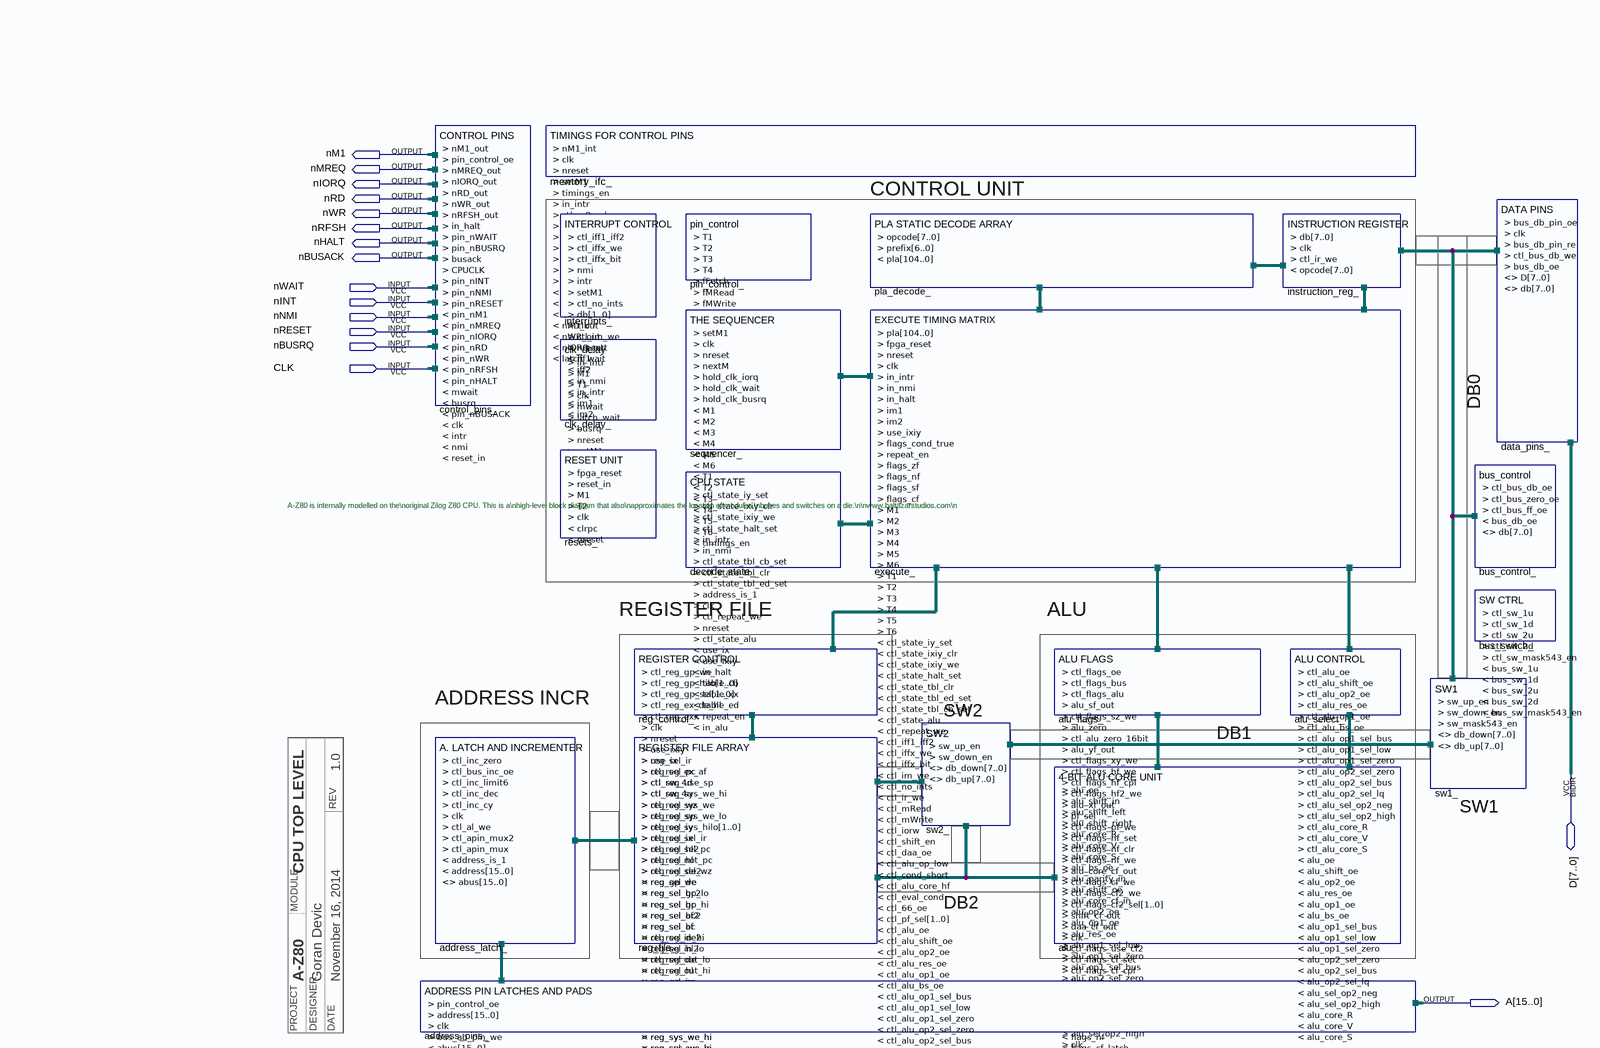
[diagram p0: schematic sheet]
// Quartus schematic toplevel.bdf as structural Verilog: 23 symbols, 16 pins
// Title block: DATE: November 16, 2014; DESIGNER: Goran Devic; MODULE: CPU TOP LEVEL; PROJECT: A-Z80; REV: 1.0
module toplevel (
  input  nWAIT,
  input  nINT,
  input  nNMI,
  input  nRESET,
  input  nBUSRQ,
  input  CLK,
  inout  [7:0] D,
  output nM1,
  output nMREQ,
  output nIORQ,
  output nRD,
  output nWR,
  output nRFSH,
  output nHALT,
  output nBUSACK,
  output [15:0] A
);

  wire alu_bs_oe, alu_core_cf_out, alu_core_R, alu_core_S, alu_core_V, alu_oe, alu_op1_oe, alu_op1_sel_bus,
       alu_op1_sel_low, alu_op1_sel_zero, alu_op2_oe, alu_op2_sel_bus, alu_op2_sel_lq, alu_op2_sel_zero,
       alu_res_oe, alu_sel_op2_high, alu_sel_op2_neg, alu_sf_out, alu_shift_oe, alu_xf_out, alu_yf_out,
       alu_zero, bus_db_oe, ctl_alu_bs_oe, ctl_alu_core_R, ctl_alu_core_S, ctl_alu_core_V, ctl_alu_oe,
       ctl_alu_op1_oe, ctl_alu_op1_sel_bus, ctl_alu_op1_sel_low, ctl_alu_op1_sel_zero, ctl_alu_op2_oe,
       ctl_alu_op2_sel_bus, ctl_alu_op2_sel_lq, ctl_alu_op2_sel_zero, ctl_alu_res_oe, ctl_alu_sel_op2_high,
       ctl_alu_sel_op2_neg, ctl_alu_shift_oe, ctl_alu_zero_16bit, ctl_flags_alu, ctl_flags_bus,
       ctl_flags_cf2_we, ctl_flags_cf_cpl, ctl_flags_cf_set, ctl_flags_cf_we, ctl_flags_hf2_we,
       ctl_flags_hf_cpl, ctl_flags_hf_we, ctl_flags_nf_clr, ctl_flags_nf_set, ctl_flags_nf_we, ctl_flags_oe,
       ctl_flags_pf_we, ctl_flags_sz_we, ctl_flags_use_cf2, ctl_flags_xy_we, ctl_ir_we, ctl_reg_ex_af,
       ctl_reg_ex_de_hl, ctl_reg_exx, ctl_reg_gp_we, ctl_reg_not_pc, ctl_reg_sel_ir, ctl_reg_sel_pc,
       ctl_reg_sel_wz, ctl_reg_sys_we, ctl_reg_sys_we_hi, ctl_reg_sys_we_lo, ctl_reg_use_sp, ctl_repeat_we,
       ctl_state_alu, ctl_state_halt_set, ctl_state_ixiy_clr, ctl_state_ixiy_we, ctl_state_iy_set,
       ctl_state_tbl_cb_set, ctl_state_tbl_clr, ctl_state_tbl_ed_set, flags_cf, flags_nf, flags_sf, flags_zf,
       in_halt, in_intr, in_nmi, M1, M2, M3, M4, M5, M6, nextM, reg_gp_we, reg_sel_af, reg_sel_af2,
       reg_sel_bc, reg_sel_bc2, reg_sel_de, reg_sel_de2, reg_sel_gp_hi, reg_sel_gp_lo, reg_sel_hl,
       reg_sel_hl2, reg_sel_ir, reg_sel_ix, reg_sel_iy, reg_sel_pc, reg_sel_sp, reg_sel_sys_hi,
       reg_sel_sys_lo, reg_sel_wz, reg_sys_we_hi, reg_sys_we_lo, repeat_en, setM1, sw_down_en, sw_up_en, T1,
       T2, T3, T4, T5, T6, use_ixiy;
  wire [1:0] ctl_flags_cf2_sel, ctl_reg_gp_hilo, ctl_reg_gp_sel, ctl_reg_sys_hilo;
  wire [7:0] db, db0, db_down, db_up, opcode;
  wire [15:0] abus, address;
  wire [104:0] pla;

  \CONTROL_PINS  control_pins_ (
    .pin_nWAIT(nWAIT), .pin_nBUSRQ(nBUSRQ), .CPUCLK(CLK), .pin_nINT(nINT), .pin_nNMI(nNMI),
    .pin_nRESET(nRESET), .pin_nM1(nM1), .pin_nMREQ(nMREQ), .pin_nIORQ(nIORQ), .pin_nRD(nRD), .pin_nWR(nWR),
    .pin_nRFSH(nRFSH), .pin_nHALT(nHALT), .pin_nBUSACK(nBUSACK));  // open: nM1_out, pin_control_oe, nMREQ_out, nIORQ_out, nRD_out, nWR_out, nRFSH_out, in_halt, busack, mwait, busrq, clk, intr, nmi, reset_in
  \A._LATCH_AND_INCREMENTER  address_latch_ (
    .clk(CLK), .address(address), .abus(abus));  // open: ctl_inc_zero, ctl_bus_inc_oe, ctl_inc_limit6, ctl_inc_dec, ctl_inc_cy, ctl_al_we, ctl_apin_mux2, ctl_apin_mux, address_is_1
  \ADDRESS_PIN_LATCHES_AND_PADS  address_pins_ (
    .address(address), .clk(CLK), .abus(abus));  // open: pin_control_oe, bus_ab_pin_we
  \TIMINGS_FOR_CONTROL_PINS  memory_ifc_ ();  // open: nM1_int, clk, nreset, setM1, timings_en, in_intr, ctl_mRead, ctl_mWrite, ctl_iorw, fIORead, fIOWrite, iorq_Tw, hold_clk_wait, nM1_out, nRFSH_out, nMREQ_out, nRD_out, nWR_out, nIORQ_out, latch_wait
  \INTERRUPT_CONTROL  interrupts_ ();  // open: ctl_iff1_iff2, ctl_iffx_we, ctl_iffx_bit, nmi, intr, setM1, ctl_no_ints, db, clk, ctl_im_we, nreset, iff1, iff2, in_nmi, in_intr, im1, im2
  clk_delay clk_delay_ ();  // open: in_intr, M1, T1, clk, mwait, latch_wait, busrq, nreset, setM1, hold_clk_iorq, iorq_Tw, hold_clk_wait, busack, hold_clk_busrq, pin_control_oe
  \RESET_UNIT  resets_ ();  // open: fpga_reset, reset_in, M1, T2, clk, clrpc, nreset
  \REGISTER_CONTROL  reg_control_ (
    .ctl_reg_gp_we(ctl_reg_gp_we), .ctl_reg_gp_hilo(ctl_reg_gp_hilo), .ctl_reg_gp_sel(ctl_reg_gp_sel),
    .ctl_reg_ex_de_hl(ctl_reg_ex_de_hl), .ctl_reg_exx(ctl_reg_exx), .clk(CLK), .nreset(nRESET),
    .use_ixiy(use_ixiy), .ctl_reg_ex_af(ctl_reg_ex_af), .ctl_reg_use_sp(ctl_reg_use_sp),
    .ctl_reg_sys_we_hi(ctl_reg_sys_we_hi), .ctl_reg_sys_we(ctl_reg_sys_we),
    .ctl_reg_sys_we_lo(ctl_reg_sys_we_lo), .ctl_reg_sys_hilo(ctl_reg_sys_hilo),
    .ctl_reg_sel_ir(ctl_reg_sel_ir), .ctl_reg_sel_pc(ctl_reg_sel_pc), .ctl_reg_not_pc(ctl_reg_not_pc),
    .ctl_reg_sel_wz(ctl_reg_sel_wz), .reg_gp_we(reg_gp_we), .reg_sel_gp_lo(reg_sel_gp_lo),
    .reg_sel_gp_hi(reg_sel_gp_hi), .reg_sel_bc2(reg_sel_bc2), .reg_sel_bc(reg_sel_bc),
    .reg_sel_de2(reg_sel_de2), .reg_sel_hl2(reg_sel_hl2), .reg_sel_de(reg_sel_de), .reg_sel_hl(reg_sel_hl),
    .reg_sel_ix(reg_sel_ix), .reg_sel_iy(reg_sel_iy), .reg_sel_af2(reg_sel_af2), .reg_sel_af(reg_sel_af),
    .reg_sel_sp(reg_sel_sp), .reg_sys_we_hi(reg_sys_we_hi), .reg_sys_we_lo(reg_sys_we_lo),
    .reg_sel_sys_lo(reg_sel_sys_lo), .reg_sel_sys_hi(reg_sel_sys_hi), .reg_sel_ir(reg_sel_ir),
    .reg_sel_pc(reg_sel_pc), .reg_sel_wz(reg_sel_wz));  // open: use_ix
  \REGISTER_FILE_ARRAY  reg_file_ (
    .reg_sel_ir(reg_sel_ir), .reg_sel_pc(reg_sel_pc), .reg_sel_wz(reg_sel_wz), .reg_sel_sp(reg_sel_sp),
    .reg_sel_iy(reg_sel_iy), .reg_sel_ix(reg_sel_ix), .reg_sel_hl2(reg_sel_hl2), .reg_sel_hl(reg_sel_hl),
    .reg_sel_de2(reg_sel_de2), .reg_sel_de(reg_sel_de), .reg_sel_bc2(reg_sel_bc2), .reg_sel_bc(reg_sel_bc),
    .reg_sel_af2(reg_sel_af2), .reg_sel_af(reg_sel_af), .reg_gp_we(reg_gp_we), .reg_sys_we_lo(reg_sys_we_lo),
    .reg_sel_sys_lo(reg_sel_sys_lo), .reg_sel_gp_lo(reg_sel_gp_lo), .clk(CLK), .reg_sys_we_hi(reg_sys_we_hi),
    .reg_sel_sys_hi(reg_sel_sys_hi), .reg_sel_gp_hi(reg_sel_gp_hi));  // open: ctl_sw_4d, ctl_sw_4u, ctl_reg_in_hi, ctl_reg_in_lo, ctl_reg_out_lo, ctl_reg_out_hi, db_lo_ds, db_lo_as, db_hi_ds, db_hi_as
  pin_control pin_control_ ();  // open: T1, T2, T3, T4, fFetch, fMRead, fMWrite, fIORead, fIOWrite, bus_ab_pin_we, bus_db_pin_oe, bus_db_pin_re
  \THE_SEQUENCER  sequencer_ (
    .setM1(setM1), .clk(CLK), .nreset(nRESET), .nextM(nextM), .M1(M1), .M2(M2), .M3(M3), .M4(M4), .M5(M5),
    .M6(M6), .T1(T1), .T2(T2), .T3(T3), .T4(T4), .T5(T5), .T6(T6));  // open: hold_clk_iorq, hold_clk_wait, hold_clk_busrq, timings_en
  \CPU_STATE  decode_state_ (
    .ctl_state_iy_set(ctl_state_iy_set), .ctl_state_ixiy_clr(ctl_state_ixiy_clr),
    .ctl_state_ixiy_we(ctl_state_ixiy_we), .ctl_state_halt_set(ctl_state_halt_set), .in_intr(in_intr),
    .in_nmi(in_nmi), .ctl_state_tbl_cb_set(ctl_state_tbl_cb_set), .ctl_state_tbl_clr(ctl_state_tbl_clr),
    .ctl_state_tbl_ed_set(ctl_state_tbl_ed_set), .clk(CLK), .ctl_repeat_we(ctl_repeat_we), .nreset(nRESET),
    .ctl_state_alu(ctl_state_alu), .use_ixiy(use_ixiy), .in_halt(in_halt), .repeat_en(repeat_en));  // open: address_is_1, use_ix, table_cb, table_xx, table_ed, in_alu
  \PLA_STATIC_DECODE_ARRAY  pla_decode_ (.opcode(opcode), .pla(pla));  // open: prefix
  \EXECUTE_TIMING_MATRIX  execute_ (
    .pla(pla), .nreset(nRESET), .clk(CLK), .in_intr(in_intr), .in_nmi(in_nmi), .in_halt(in_halt),
    .use_ixiy(use_ixiy), .repeat_en(repeat_en), .flags_zf(flags_zf), .flags_nf(flags_nf),
    .flags_sf(flags_sf), .flags_cf(flags_cf), .M1(M1), .M2(M2), .M3(M3), .M4(M4), .M5(M5), .M6(M6), .T1(T1),
    .T2(T2), .T3(T3), .T4(T4), .T5(T5), .T6(T6), .ctl_state_iy_set(ctl_state_iy_set),
    .ctl_state_ixiy_clr(ctl_state_ixiy_clr), .ctl_state_ixiy_we(ctl_state_ixiy_we),
    .ctl_state_halt_set(ctl_state_halt_set), .ctl_state_tbl_clr(ctl_state_tbl_clr),
    .ctl_state_tbl_ed_set(ctl_state_tbl_ed_set), .ctl_state_tbl_cb_set(ctl_state_tbl_cb_set),
    .ctl_state_alu(ctl_state_alu), .ctl_repeat_we(ctl_repeat_we), .ctl_ir_we(ctl_ir_we),
    .ctl_alu_oe(ctl_alu_oe), .ctl_alu_shift_oe(ctl_alu_shift_oe), .ctl_alu_op2_oe(ctl_alu_op2_oe),
    .ctl_alu_res_oe(ctl_alu_res_oe), .ctl_alu_op1_oe(ctl_alu_op1_oe), .ctl_alu_bs_oe(ctl_alu_bs_oe),
    .ctl_alu_op1_sel_bus(ctl_alu_op1_sel_bus), .ctl_alu_op1_sel_low(ctl_alu_op1_sel_low),
    .ctl_alu_op1_sel_zero(ctl_alu_op1_sel_zero), .ctl_alu_op2_sel_zero(ctl_alu_op2_sel_zero),
    .ctl_alu_op2_sel_bus(ctl_alu_op2_sel_bus), .ctl_alu_op2_sel_lq(ctl_alu_op2_sel_lq),
    .ctl_alu_sel_op2_neg(ctl_alu_sel_op2_neg), .ctl_alu_sel_op2_high(ctl_alu_sel_op2_high),
    .ctl_alu_core_R(ctl_alu_core_R), .ctl_alu_core_V(ctl_alu_core_V), .ctl_alu_core_S(ctl_alu_core_S),
    .ctl_flags_oe(ctl_flags_oe), .ctl_flags_bus(ctl_flags_bus), .ctl_flags_alu(ctl_flags_alu),
    .ctl_flags_nf_set(ctl_flags_nf_set), .ctl_flags_cf_set(ctl_flags_cf_set),
    .ctl_flags_cf_cpl(ctl_flags_cf_cpl), .ctl_flags_cf_we(ctl_flags_cf_we),
    .ctl_flags_sz_we(ctl_flags_sz_we), .ctl_flags_xy_we(ctl_flags_xy_we), .ctl_flags_hf_we(ctl_flags_hf_we),
    .ctl_flags_pf_we(ctl_flags_pf_we), .ctl_flags_nf_we(ctl_flags_nf_we),
    .ctl_flags_cf2_we(ctl_flags_cf2_we), .ctl_flags_hf_cpl(ctl_flags_hf_cpl),
    .ctl_flags_use_cf2(ctl_flags_use_cf2), .ctl_flags_hf2_we(ctl_flags_hf2_we),
    .ctl_flags_nf_clr(ctl_flags_nf_clr), .ctl_alu_zero_16bit(ctl_alu_zero_16bit),
    .ctl_flags_cf2_sel(ctl_flags_cf2_sel), .ctl_reg_exx(ctl_reg_exx), .ctl_reg_ex_af(ctl_reg_ex_af),
    .ctl_reg_ex_de_hl(ctl_reg_ex_de_hl), .ctl_reg_use_sp(ctl_reg_use_sp), .ctl_reg_sel_pc(ctl_reg_sel_pc),
    .ctl_reg_sel_ir(ctl_reg_sel_ir), .ctl_reg_sel_wz(ctl_reg_sel_wz), .ctl_reg_gp_we(ctl_reg_gp_we),
    .ctl_reg_not_pc(ctl_reg_not_pc), .ctl_reg_sys_we_lo(ctl_reg_sys_we_lo),
    .ctl_reg_sys_we_hi(ctl_reg_sys_we_hi), .ctl_reg_sys_we(ctl_reg_sys_we),
    .ctl_reg_gp_hilo(ctl_reg_gp_hilo), .ctl_reg_gp_sel(ctl_reg_gp_sel), .ctl_reg_sys_hilo(ctl_reg_sys_hilo),
    .nextM(nextM), .setM1(setM1));  // open: fpga_reset, im1, im2, flags_cond_true, ctl_iff1_iff2, ctl_iffx_we, ctl_iffx_bit, ctl_im_we, ctl_no_ints, ctl_mRead, ctl_mWrite, ctl_iorw, ctl_shift_en, ctl_daa_oe, ctl_alu_op_low, ctl_cond_short, ctl_alu_core_hf, ctl_eval_cond, ctl_66_oe, ctl_pf_sel, ctl_sw_4d, ctl_sw_4u, ctl_reg_in_hi, ctl_reg_in_lo, ctl_reg_out_lo, ctl_reg_out_hi, ctl_inc_cy, ctl_inc_dec, ctl_inc_zero, ctl_al_we, ctl_inc_limit6, ctl_bus_inc_oe, ctl_apin_mux, ctl_apin_mux2, ctl_bus_ff_oe, ctl_bus_zero_oe, ctl_bus_db_oe, ctl_sw_1u, ctl_sw_1d, ctl_sw_2u, ctl_sw_2d, ctl_sw_mask543_en, ctl_bus_db_we, fFetch, fMRead, fMWrite, fIORead, fIOWrite
  SW2 sw2_ (.sw_up_en(sw_up_en), .sw_down_en(sw_down_en), .db_down(db_down), .db_up(db_up));
  \ALU_FLAGS  alu_flags_ (
    .ctl_flags_oe(ctl_flags_oe), .ctl_flags_bus(ctl_flags_bus), .ctl_flags_alu(ctl_flags_alu),
    .alu_sf_out(alu_sf_out), .ctl_flags_sz_we(ctl_flags_sz_we), .alu_zero(alu_zero),
    .ctl_alu_zero_16bit(ctl_alu_zero_16bit), .alu_yf_out(alu_yf_out), .ctl_flags_xy_we(ctl_flags_xy_we),
    .ctl_flags_hf_we(ctl_flags_hf_we), .ctl_flags_hf_cpl(ctl_flags_hf_cpl),
    .ctl_flags_hf2_we(ctl_flags_hf2_we), .alu_xf_out(alu_xf_out), .ctl_flags_pf_we(ctl_flags_pf_we),
    .ctl_flags_nf_set(ctl_flags_nf_set), .ctl_flags_nf_clr(ctl_flags_nf_clr),
    .ctl_flags_nf_we(ctl_flags_nf_we), .alu_core_cf_out(alu_core_cf_out), .ctl_flags_cf_we(ctl_flags_cf_we),
    .ctl_flags_cf2_we(ctl_flags_cf2_we), .ctl_flags_cf2_sel(ctl_flags_cf2_sel), .clk(CLK),
    .ctl_flags_use_cf2(ctl_flags_use_cf2), .ctl_flags_cf_set(ctl_flags_cf_set),
    .ctl_flags_cf_cpl(ctl_flags_cf_cpl), .flags_sf(flags_sf), .flags_zf(flags_zf), .flags_nf(flags_nf),
    .flags_cf(flags_cf), .db(db));  // open: pf_sel, shift_cf_out, daa_cf_out, flags_hf, flags_hf2, flags_pf, flags_cf_latch
  \4-BIT_ALU_CORE_UNIT  alu_ (
    .alu_oe(alu_oe), .alu_core_R(alu_core_R), .alu_core_V(alu_core_V), .alu_core_S(alu_core_S),
    .alu_bs_oe(alu_bs_oe), .alu_shift_oe(alu_shift_oe), .alu_op2_oe(alu_op2_oe), .alu_op1_oe(alu_op1_oe),
    .alu_res_oe(alu_res_oe), .alu_op1_sel_low(alu_op1_sel_low), .alu_op1_sel_zero(alu_op1_sel_zero),
    .alu_op1_sel_bus(alu_op1_sel_bus), .alu_op2_sel_zero(alu_op2_sel_zero),
    .alu_op2_sel_bus(alu_op2_sel_bus), .alu_op2_sel_lq(alu_op2_sel_lq), .alu_sel_op2_neg(alu_sel_op2_neg),
    .alu_sel_op2_high(alu_sel_op2_high), .clk(CLK), .alu_zero(alu_zero), .alu_core_cf_out(alu_core_cf_out),
    .alu_sf_out(alu_sf_out), .alu_yf_out(alu_yf_out), .alu_xf_out(alu_xf_out), .db(db));  // open: alu_shift_in, alu_shift_left, alu_shift_right, alu_parity_in, alu_core_cf_in, alu_op_low, bsel, alu_parity_out, alu_high_eq_9, alu_high_gt_9, alu_low_gt_9, alu_shift_db0, alu_shift_db7, alu_vf_out, test_db_low, test_db_high
  \INSTRUCTION_REGISTER  instruction_reg_ (.db(db0), .clk(CLK), .ctl_ir_we(ctl_ir_we), .opcode(opcode));
  \ALU_CONTROL  alu_select_ (
    .ctl_alu_oe(ctl_alu_oe), .ctl_alu_shift_oe(ctl_alu_shift_oe), .ctl_alu_op2_oe(ctl_alu_op2_oe),
    .ctl_alu_res_oe(ctl_alu_res_oe), .ctl_alu_op1_oe(ctl_alu_op1_oe), .ctl_alu_bs_oe(ctl_alu_bs_oe),
    .ctl_alu_op1_sel_bus(ctl_alu_op1_sel_bus), .ctl_alu_op1_sel_low(ctl_alu_op1_sel_low),
    .ctl_alu_op1_sel_zero(ctl_alu_op1_sel_zero), .ctl_alu_op2_sel_zero(ctl_alu_op2_sel_zero),
    .ctl_alu_op2_sel_bus(ctl_alu_op2_sel_bus), .ctl_alu_op2_sel_lq(ctl_alu_op2_sel_lq),
    .ctl_alu_sel_op2_neg(ctl_alu_sel_op2_neg), .ctl_alu_sel_op2_high(ctl_alu_sel_op2_high),
    .ctl_alu_core_R(ctl_alu_core_R), .ctl_alu_core_V(ctl_alu_core_V), .ctl_alu_core_S(ctl_alu_core_S),
    .alu_oe(alu_oe), .alu_shift_oe(alu_shift_oe), .alu_op2_oe(alu_op2_oe), .alu_res_oe(alu_res_oe),
    .alu_op1_oe(alu_op1_oe), .alu_bs_oe(alu_bs_oe), .alu_op1_sel_bus(alu_op1_sel_bus),
    .alu_op1_sel_low(alu_op1_sel_low), .alu_op1_sel_zero(alu_op1_sel_zero),
    .alu_op2_sel_zero(alu_op2_sel_zero), .alu_op2_sel_bus(alu_op2_sel_bus), .alu_op2_sel_lq(alu_op2_sel_lq),
    .alu_sel_op2_neg(alu_sel_op2_neg), .alu_sel_op2_high(alu_sel_op2_high), .alu_core_R(alu_core_R),
    .alu_core_V(alu_core_V), .alu_core_S(alu_core_S));
  SW1 sw1_ (.sw_up_en(sw_up_en), .sw_down_en(sw_down_en), .db_down(db_down), .db_up(db_up));  // open: sw_mask543_en
  \DATA_PINS  data_pins_ (.D(D), .db(db0));  // open: bus_db_pin_oe, clk, bus_db_pin_re, ctl_bus_db_we, bus_db_oe
  bus_control bus_control_ (.bus_db_oe(bus_db_oe), .db(db));  // open: ctl_bus_db_oe, ctl_bus_zero_oe, ctl_bus_ff_oe
  \SW_CTRL  bus_switch_ ();  // open: ctl_sw_1u, ctl_sw_1d, ctl_sw_2u, ctl_sw_2d, ctl_sw_mask543_en, bus_sw_1u, bus_sw_1d, bus_sw_2u, bus_sw_2d, bus_sw_mask543_en

  // Notes on the sheet:
  //   CONTROL UNIT
  //   DB0
  //   A-Z80 is internally modelled on the\noriginal Zilog Z80 CPU. This is a\nhigh-level block diagram that also\napproximates the location of modules,\nbuses and switches on a die.\n\nwww.baltazarstudios.com\n
  //   REGISTER FILE
  //   ALU
  //   ADDRESS INCR
  //   SW2
  //   DB1
  //   SW1
  //   DB2
endmodule
